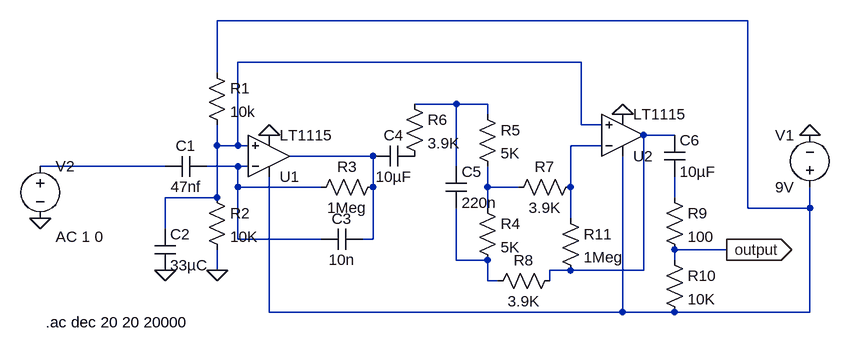
[diagram p0: schematic REAL_CIRCUIT.asc]
REAL_CIRCUIT.asc, the LTspice schematic file:
Version 4.1
SHEET 1 1108 680
WIRE 976 -16 160 -16
WIRE 720 48 192 48
WIRE 160 64 160 -16
WIRE 528 112 464 112
WIRE 576 112 528 112
WIRE 576 128 576 112
WIRE 720 144 720 48
WIRE 752 144 720 144
WIRE 864 160 816 160
WIRE 160 176 160 144
WIRE 192 176 192 48
WIRE 192 176 160 176
WIRE 208 176 192 176
WIRE 752 176 704 176
WIRE 400 192 272 192
WIRE 80 208 -112 208
WIRE 192 208 144 208
WIRE 208 208 192 208
WIRE 528 208 528 112
WIRE 192 240 192 208
WIRE 320 240 192 240
WIRE 400 240 400 192
WIRE 576 240 576 208
WIRE 624 240 576 240
WIRE 704 240 704 176
WIRE 160 256 160 176
WIRE 160 256 80 256
WIRE 864 256 864 224
WIRE 576 272 576 240
WIRE 976 272 976 -16
WIRE 1072 272 1072 240
WIRE 1072 272 976 272
WIRE 704 288 704 240
WIRE 80 304 80 256
WIRE 192 320 192 240
WIRE 320 320 192 320
WIRE 400 320 400 240
WIRE 400 320 384 320
WIRE 944 336 864 336
WIRE 528 352 528 272
WIRE 576 352 528 352
WIRE 864 352 864 336
WIRE 160 368 160 336
WIRE 704 368 672 368
WIRE 816 368 816 160
WIRE 816 368 704 368
WIRE 576 384 576 352
WIRE 592 384 576 384
WIRE 672 384 672 368
WIRE 240 432 240 224
WIRE 784 432 784 192
WIRE 784 432 240 432
WIRE 864 432 784 432
WIRE 1072 432 1072 272
WIRE 1072 432 864 432
FLAG -112 288 0
FLAG 160 368 0
FLAG 80 368 0
FLAG 1072 160 0
FLAG 240 160 0
FLAG 784 128 0
FLAG 944 336 output
IOPIN 944 336 Out
SYMBOL cap 144 192 R90
WINDOW 0 0 32 VBottom 2
WINDOW 3 32 32 VTop 2
SYMATTR InstName C1
SYMATTR Value 47nf
SYMBOL res 144 48 R0
SYMATTR InstName R1
SYMATTR Value 10k
SYMBOL voltage -112 192 R0
WINDOW 123 24 124 Left 2
WINDOW 39 0 0 Left 0
SYMATTR InstName V2
SYMATTR Value ""
SYMATTR Value2 AC 1 0
SYMBOL res 144 240 R0
SYMATTR InstName R2
SYMATTR Value 10K
SYMBOL cap 64 304 R0
SYMATTR InstName C2
SYMATTR Value 33µC
SYMBOL res 416 224 R90
WINDOW 0 0 56 VBottom 2
WINDOW 3 32 56 VTop 2
SYMATTR InstName R3
SYMATTR Value 1Meg
SYMBOL cap 384 304 R90
WINDOW 0 0 32 VBottom 2
WINDOW 3 32 32 VTop 2
SYMATTR InstName C3
SYMATTR Value 10n
SYMBOL OpAmps\\LT1115 240 256 M180
SYMATTR InstName U1
SYMBOL voltage 1072 256 R180
WINDOW 0 24 96 Left 2
WINDOW 3 24 16 Left 2
WINDOW 123 0 0 Left 0
WINDOW 39 0 0 Left 0
SYMATTR InstName V1
SYMATTR Value 9V
SYMBOL cap 464 176 R90
WINDOW 0 0 32 VBottom 2
WINDOW 3 32 32 VTop 2
SYMATTR InstName C4
SYMATTR Value 10µF
SYMBOL res 560 256 R0
SYMATTR InstName R4
SYMATTR Value 5K
SYMBOL res 560 112 R0
SYMATTR InstName R5
SYMATTR Value 5K
SYMBOL res 448 96 R0
SYMATTR InstName R6
SYMATTR Value 3.9K
SYMBOL cap 512 208 R0
SYMATTR InstName C5
SYMATTR Value 220n
SYMBOL res 720 224 R90
WINDOW 0 0 56 VBottom 2
WINDOW 3 32 56 VTop 2
SYMATTR InstName R7
SYMATTR Value 3.9K
SYMBOL OpAmps\\LT1115 784 224 M180
SYMATTR InstName U2
SYMBOL res 688 368 R90
WINDOW 0 0 56 VBottom 2
WINDOW 3 32 56 VTop 2
SYMATTR InstName R8
SYMATTR Value 3.9K
SYMBOL cap 848 160 R0
SYMATTR InstName C6
SYMATTR Value 10µF
SYMBOL res 848 240 R0
SYMATTR InstName R9
SYMATTR Value 100
SYMBOL res 848 336 R0
SYMATTR InstName R10
SYMATTR Value 10K
SYMBOL res 688 272 R0
SYMATTR InstName R11
SYMATTR Value 1Meg
TEXT -104 448 Left 2 !.ac dec 20 20 20000

The netlist it stands for:
* REAL_CIRCUIT.asc
C1 N008 N007 47nf
R1 N001 N002 10k
V2 N007 0 AC 1 0
R2 N002 0 10K
C2 N002 0 33µC
R3 N006 N008 1Meg
C3 N006 N008 10n
X§U1 N002 N008 N001 0 N006 LT1028  ; LT1115, pins In+ In- V+ V- OUT
V1 N001 0 9V
C4 P001 N006 10µF
R4 N009 N011 5K
R5 N003 N009 5K
R6 N003 P001 3.9K
C5 N003 N011 220n
R7 N005 N009 3.9K
X§U2 N002 N005 N001 0 N004 LT1028  ; LT1115, pins In+ In- V+ V- OUT
R8 N004 N011 3.9K
C6 N004 N010 10µF
R9 N010 output 100
R10 output N001 10K
R11 N005 N004 1Meg
.ac dec 20 20 20000
.lib LTC.lib
.backanno
.end